# Altium schematic sheet AC-DC24_Overall.SchDoc
size A4; SheetNumber: 1; SheetTotal: 1
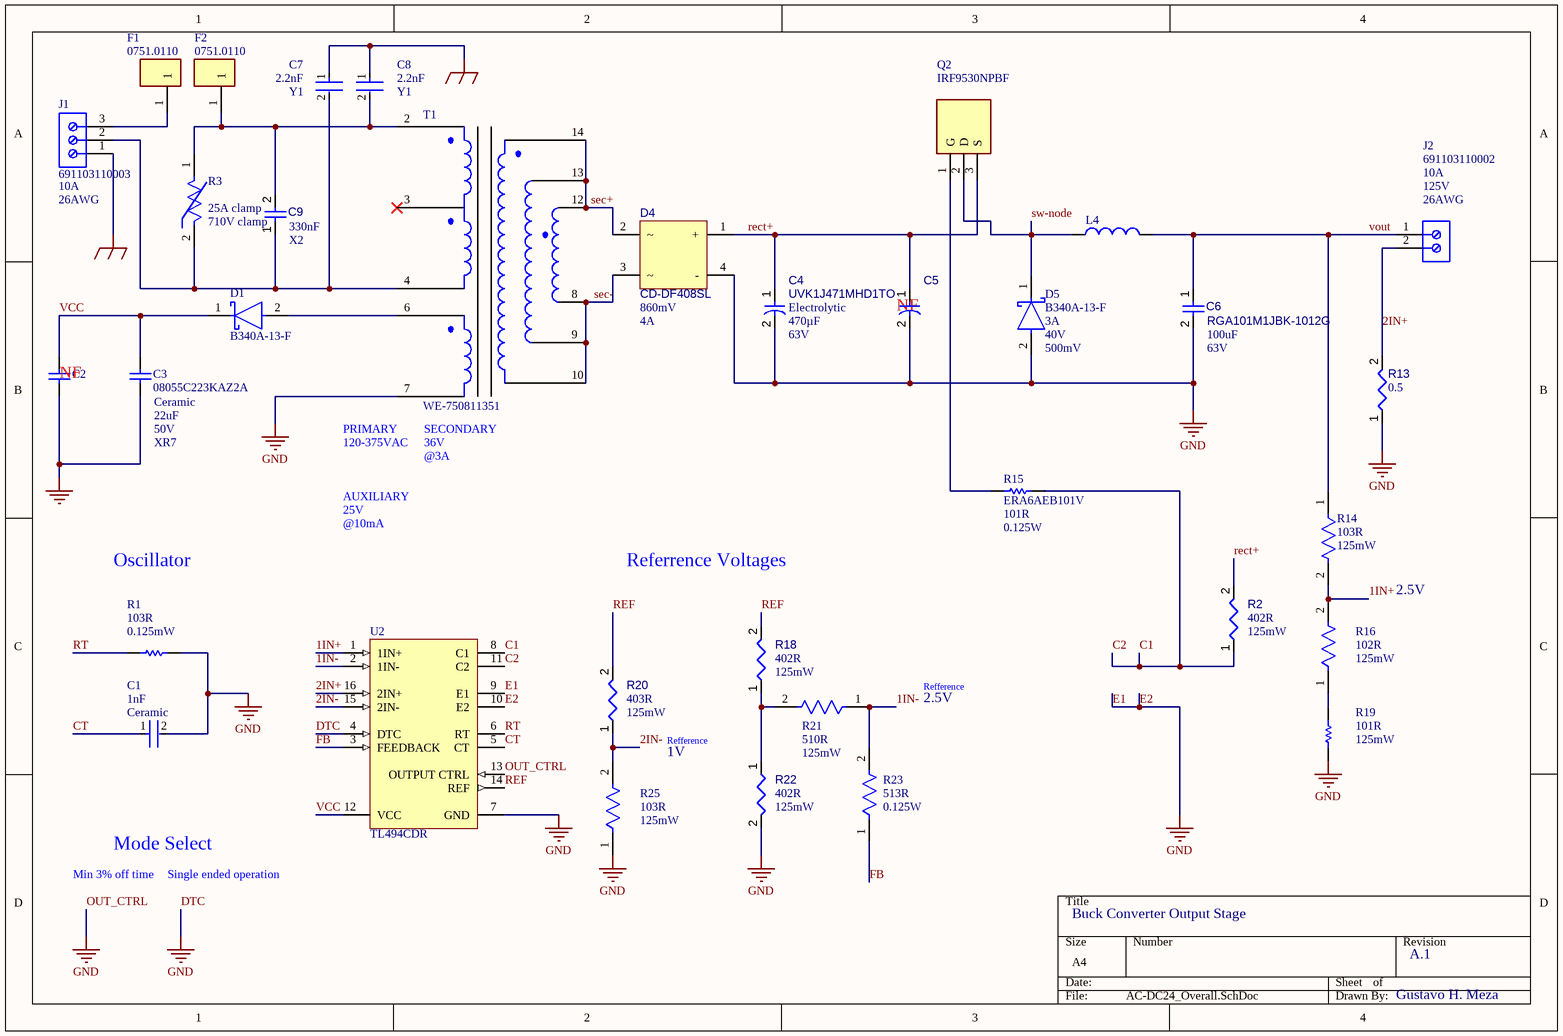
[diagram p0: AC-DC24_Overall.SchDoc]

## Parts
C1  Capacitance: 1nF  Dielectric Material: Ceramic  [FP-0805-L_2_01_0_2-W_1_25-MFG]  (hidden comment: 08051A102JAT2A)
C2  08055C223KAZ2A  [CAPC2013X94X50ML20T25]  (value not drawn)
C3  08055C223KAZ2A  Material: Ceramic  Dielectric: XR7  Voltage rating: 50V  Capacitance: 22uF  [CAPC2013X94X50ML20T25]
C4  UVK1J471MHD1TO  value 470µF  Capacitor Type: Electrolytic  Voltage Rating: 63V  [UVK1J471MHD1TO-Footprint-1]
C5  UVK1J471MHD1TO  [UVK1J471MHD1TO-Footprint-1]  (value not drawn)
C6  RGA101M1JBK-1012G  Voltage Rating: 63V  Capacitance: 100uF  [RGA101M1JBK-1012G-Footprint-1]
C7  Capacitance: 2.2nF  Safety rating: Y1  [FP-VY1470-MFG]  (hidden comment: VY1222M47Y5UQ6TV0)
C8  Capacitance: 2.2nF  Safety rating: Y1  [FP-VY1470-MFG]  (hidden comment: VY1222M47Y5UQ6TV0)
C9  value 330nF  Safety rating: X2  [B32922C3334M000-Footprint-1]  (hidden comment: B32922C3334M000)
D1  B340A-13-F  [FP-SMA-MFG]
D4  CD-DF408SL  Forward Voltage: 860mV  Forward Current: 4A  [CD-DF408SL-Footprint-1]
D5  B340A-13-F  Output Current: 3A  Voltage: 40V  Forward Voltage: 500mV  [FP-SMA-MFG]
F1  0751.0110  [FP-0751_0110-MFG]
F2  0751.0110  [FP-0751_0110-MFG]
J1  691103110003  Current Rating: 10A  Wire/Cable Gauge: 26AWG  [691103110003]
J2  691103110002  Current Rating: 10A  Voltage: 125V  Wire/Cable Gauge: 26AWG  [691103110002]
L4  FIT80-1  [FIT80-1-Footprint-1]  (value not drawn)
Q2  IRF9530NPBF  [TO254P469X1042X1967-3P]
R1  Resistance: 103R  Power: 0.125mW  [RESC2013X60X35ML10T20]  (hidden comment: RC0805JR-0710KL)
R2  value 402R  Power: 125mW  [RESC3416X05N]  (hidden comment: CRCW08054K00FKTA)
R3  Clamping Current: 25A clamp  Clamping Voltage: 710V clamp  [FP-B72210S2271K101-MFG]  (hidden comment: B72210S2271K101)
R13  value 0.5  [RS02CR5000FB12-Footprint-1]  (hidden comment: RS02CR5000FB12)
R14  Resistance: 103R  Power Rating: 125mW  [FP-CRCW0805-e3-IPC_A]  (hidden comment: CRCW080510K0FKEA)
R15  ERA6AEB101V  Resistance: 101R  Power rating: 0.125W  [RESC2013X60X40ML20T25]
R16  Power Rating: 125mW  Resistance: 102R  [FP-CRCW0805-e3-IPC_B]  (hidden comment: CRCW08051K00JNEA)
R18  value 402R  Power: 125mW  [RESC3416X05N]  (hidden comment: CRCW08054K00FKTA)
R19  Resistancemeter 1: 101R  Power: 125mW  [RESC2013X60X40ML20T25]  (hidden comment: ERA6AEB101V)
R20  value 403R  Power: 125mW  [RESC3416X05N]  (hidden comment: CRCW08054K00FKTA)
R21  Resistance: 510R  Power Rating: 125mW  [FP-CR0805-IPC_B]  (hidden comment: CR0805JW511E)
R22  value 402R  Power: 125mW  [RESC3416X05N]  (hidden comment: CRCW08054K00FKTA)
R23  value 513R  Power Rating: 0.125W  [FP-RT0805-MFG]  (hidden comment: RT0805BRD0751KL)
R25  Resistance: 103R  Max Power Dissipation: 125mW  [FP-ERA6A-IPC_C]  (hidden comment: ERA6AEB102V)
T1  WE-750811351  [WE-750811248-Footprint-1]
U2  TL494CDR  [D0016A_N]

## Nets
DTC: C1.2 C2.1 C3.1 C4.2 C5.2 C6.2 C7.1 C8.1 D4.4(-) D5.2(A) J1.1 R1.2 R13.1 R19.1 R22.2 R25.1 T1.7 U2.4(DTC) U2.7(GND) U2.9(E1) U2.10(E2) U2.13(OUTPUT_CTRL)  [also labelled E1, E2, GND, OUT_CTRL]
1IN+: R14.2 R16.2 U2.1(1IN+)
1IN-: R21.1 R23.2 U2.2(1IN-)
2IN+: J2.2 R13.2 U2.16(2IN+)
2IN-: R20.1 R25.2 U2.15(2IN-)
C1: R2.1 R15.1 U2.8(C1) U2.11(C2)  [also labelled C2]
CT: C1.1 U2.5(CT)
FB: R23.1 U2.3(FEEDBACK)
rect+: C4.1 C5.1 D4.1(+) Q2.3(S) R2.2
REF: R18.2 R20.2 U2.14(REF)
RT: R1.1 U2.6(RT)
sec+: D4.2 T1.12 T1.13 T1.14
sec-: D4.3 T1.8 T1.9 T1.10
sw-node: D5.1(C) L4.1 Q2.2(D)
VCC: C2.2 C3.2 D1.1(C) U2.12(VCC)
vout: C6.1 J2.1 L4.2 R14.1
NetC7_2: C7.2 C9.1 J1.2 R3.2 T1.4
NetC8_2: C8.2 C9.2 F2.1 R3.1 T1.2
NetD1_2: D1.2(A) T1.6
NetF1_1: F1.1 J1.3
NetQ2_1: Q2.1(G) R15.2
NetR16_1: R16.1 R19.2
NetR18_1: R18.1 R21.2 R22.1

Not connected (* = marked no-connect by the designer): T1 1 3

## Notes on the sheet
- (near C5) NF
- (near C2) NF
- (near T1) 120-375VAC
- (near T1) PRIMARY
- (near T1) 36V
- (near T1) SECONDARY
- 25V
- AUXILIARY
- @3A
- Oscillator
- @10mA
- Referrence Voltages
- 2.5V
- Refference
- 1V
- Mode Select
- Min 3% off time
- Single ended operation
- Buck Converter Output Stage
- A.1
- Gustavo H. Meza

## Library data of the parts
C1 = CMP-2007-04527-2: General Purpose Ceramic Capacitor, 0805, 1nF, 5%, C0G, 30ppm/°C, 100V; Insulation Resistance: 100GR; Dissipation Factor: 2.5%; Mount: Surface Mount; Package Quantity: 1; Voltage: 100V; Lead Free: Lead Free; Case/Package: 0805; Voltage Rating: 100V; Dielectric: C0G; Case Code (Metric): 2012; Case Code (Imperial): 0805; REACH SVHC: No SVHC; Number of Pins: 2; Length: 2.01mm; Temperature Coefficient: 30ppm/°C; Depth: 1.25mm; Radiation Hardening: No; RoHS Compliant: Yes; Packaging: Tape and Reel; Min Operating Temperature: -55°C; Contact Plating: Tin; Tolerance: 5%; Termination: SMD/SMT; Height: 0.94mm; Thickness: 0.037inch; Voltage Rating (DC): 100V; Max Operating Temperature: 125°C; Width: 1.25mm
C2 = CMP-2007-04398-1: Manufacturer: AVX Interconnect / Elco; Material: Ceramic; Dielectric: XR7; Voltage rating: 50V; Capacitance: 22uF; Part Number: 08055C223KAZ2A
C3 = CMP-2007-04398-1: Manufacturer: AVX Interconnect / Elco; Part Number: 08055C223KAZ2A
C4 = CMP-001-00087-2: Cap Alum 470UF 20% 63V Radial; Ripple Current: 900mA; Dielectric Material: Aluminium; RoHS Compliant: Yes; Diameter: 12.5mm; Max Operating Temperature: 85°C; Min Operating Temperature: -40°C; Pins: 2
C5 = CMP-001-00087-2: Cap Alum 470UF 20% 63V Radial; Capacitor Type: Electrolytic; Value: 470µF; Ripple Current: 900mA; Dielectric Material: Aluminium; RoHS Compliant: Yes; Diameter: 12.5mm; Max Operating Temperature: 85°C; Min Operating Temperature: -40°C; Voltage Rating: 63V; Pins: 2
C6 = CMP-001-00089-1: Aluminum Electrolytic Capacitors - Leaded 63V 100uF 105C 10x12.5 mm
C7 C8 = CMP-02417-000069-1: CAP CER 2200PF 760VAC Y5U RADIAL; Lead Diameter: 0.6mm; Ratings: X1; Voltage Rating (AC): 500V; Lead/Base Style: Kinked; Tolerance: 20%; Max Operating Temperature: 125°C; Resistor Type: Ceramic; Contact Plating: Tin; Thickness: 5mm; Width: 5mm; Min Operating Temperature: -40°C; Depth: 5mm; Mount: Through Hole; Termination: Radial; Lead Free: Lead Free; Diameter: 12mm; Height: 15mm; Radiation Hardening: No; Lead Pitch: 10mm; Case/Package: Radial; RoHS Compliant: Yes; Series: VY1; Dielectric: Y5U; Construction: RADIAL; Voltage: 500V; Voltage Rating (DC): 500V; Packaging: Tape and Reel; Height - Seated (Max): 0.63inch; Package Quantity: 500
C9 = CMP-001-00088-1: Film Capacitor, Polypropylene, 630V, 20% +Tol, 20% -Tol, 0.33uF, Through Hole Mount; Max Operating Temperature: 110°C; Min Operating Temperature: -40°C; RoHS Compliant: Yes; Dielectric Material: Polypropylene; Pins: 2; Height: 8mm; Mounting Technology: Through Hole; Capacitor Type: FILM; Case/Package: 7155
D1 = CMP-1667-00003-3: DIODE SCHOTTKY 40V 3A SMA; Max Forward Surge Current (Ifsm): 80A; Forward Voltage: 500mV; Polarity: Standard; Max Reverse Current: 500uA; Capacitance: 250pF; Element Configuration: Single; Mount: Surface Mount; Output Current: 3A; Radiation Hardening: No; Width: 2.92mm; Current Rating: 3A; Termination: SMD/SMT; Voltage: 40V; Series: -; Max Operating Temperature: 125°C; Current: 3A; Max Repetitive Reverse Voltage (Vrrm): 40V; Min Operating Temperature: -55°C; REACH SVHC: No SVHC; Number of Pins: 2; Average Rectified Current: 3A; Contact Plating: Tin; RoHS Compliant: Yes; Max Reverse Voltage (DC): 40V; Packaging: Tape and Reel; Height: 2.3mm; Length: 4.6mm; Case/Package: SMA; Weight: 0.002258oz; Peak Non-Repetitive Surge Current: 80A; Package Quantity: 5000; Lead Free: Lead Free; Forward Current: 3A; Voltage Rating (DC): 40V
D4 = CMP-004-00034-1: Bridge Rectifier Diode, 1 Phase, 4A, 800V V(RRM), Silicon; Max Surge Current: 150A; Reach SVHC Compliant: No; Min Operating Temperature: -55°C; Max Operating Temperature: 175°C; RoHS Compliant: Yes; Mounting Technology: Flat; JESD-609 Code: e3; Diode Type: RECTIFIER
D5 = CMP-1667-00003-3: DIODE SCHOTTKY 40V 3A SMA; Max Forward Surge Current (Ifsm): 80A; Polarity: Standard; Max Reverse Current: 500uA; Capacitance: 250pF; Element Configuration: Single; Mount: Surface Mount; Radiation Hardening: No; Width: 2.92mm; Current Rating: 3A; Termination: SMD/SMT; Series: -; Max Operating Temperature: 125°C; Current: 3A; Max Repetitive Reverse Voltage (Vrrm): 40V; Min Operating Temperature: -55°C; REACH SVHC: No SVHC; Number of Pins: 2; Average Rectified Current: 3A; Contact Plating: Tin; RoHS Compliant: Yes; Max Reverse Voltage (DC): 40V; Packaging: Tape and Reel; Height: 2.3mm; Length: 4.6mm; Case/Package: SMA; Weight: 0.002258oz; Peak Non-Repetitive Surge Current: 80A; Package Quantity: 5000; Lead Free: Lead Free; Forward Current: 3A; Voltage Rating (DC): 40V
F1 F2 = CMP-26292-000006-1: FUSE CLIP CARTRIDGE 10A PCB; Manufacturer: Schurter; Conn Orientation: Horizontal; Voltage Rating Ac: 500V; Number Of Fuses: 1; ComponentLink2Description: Datasheet; ComponentLink2URL: https://us.schurter.com/bundles/snceschurter/epim/_ProdPool_/newDS/en/typ_OG__Clip__5x20.pdf; Package: 0; Device Class L1: Circuit Protection; Lead Free: Yes; RoHS: TRUE; Voltage Rating Dc: 500V; Device Class L3: unset; Ambient Temperature Range Low: -40°C; Manufacturer Part Number: 0751.0110; Device Class L2: Fuse Holders; Octopart: https://octopart.com/0751.0110-schurter-19402; Height: 8.9mm; Digikey Description: FUSE CLIP CARTRIDGE 10A PCB; Ambient Temperature Range High: +85°C; Category: Fuse; Fuse Current: 10A; Automotive: No
J1 = CMP-1502-03255-2: NexarPartId: 18818287; Pitch: 3.5052mm; Number of Contacts: 3; Stripping Length: -6mm; Voltage Rating: 125V; Number of Levels: 1; Height: 12.2mm; Color: Blue; RoHS: Compliant; Packaging: Box; Housing Material: Nylon; Termination: Screw; Width: 11.5mm; Lead Pitch: 3.5mm; Number of Positions Per Level: 3; Number of Pins: 3; Contact Material: Brass; Length: 7mm; REACH SVHC: Unknown
J2 = CMP-1502-03254-2: NexarPartId: 18818286; Pitch: 3.5052mm; Number of Positions Per Level: 2; Plating: Steel; Number of Levels: 1; Stripping Length: -6mm; Wire Gauge (Min): 16AWG; Packaging: Box; Number of Rows: 1; Color: Blue; Height: 8.5mm; Current: 10A; Lead Pitch: 3.5mm; RoHS: Compliant; Housing Material: Nylon; Width: 8mm; Length: 7mm; Contact Plating: Tin; Number of Pins: 2; Mount: Through Hole; Min Operating Temperature: -40°C; Number of Contacts: 2; REACH SVHC: Unknown; Termination: Screw; Wire Gauge (Max): 26AWG; Max Operating Temperature: 105°C; Voltage Rating: 125V; Contact Material: Brass, Copper, Nickel, Tin, Zinc
L4 = CMP-006-00026-3: General Purpose Inductor, 128uH, 1 Element, 9863; DC Resistance (DCR): 95.2mR; Max Current Rating: 4A; Case/Size Code: 9863; Pins: 2; Inductance-Nom (L): 128uH; Construction: Toroidal; RoHS Compliant: Yes
Q2 = CMP-033-000000-2: MOSFET MOSFT PCh -100V -14A 200mOhm 38.7nC; Manufacturer_Name: Infineon; Geometry.Height: 4.69mm; Mouser Price/Stock: https://www.mouser.co.uk/ProductDetail/Infineon-Technologies/IRF9530NPBF?qs=9%252BKlkBgLFf2oWmEcBf5aZQ%3D%3D; Datasheet Link: https://www.infineon.com/dgdl/irf9530npbf.pdf?fileId=5546d462533600a401535611b9931dc1; Design Item ID: IRF9530NPBF; Manufacturer_Part_Number: IRF9530NPBF; Mouser Part Number: 942-IRF9530NPBF; Source: IRF9530NPBF.SchLib
R1 = CMP-2000-05025-1: Chip Resistor, 10 KOhm, +/- 5%, 0.125 W, -55 to 155 degC, 0805 (2012 Metric), RoHS, Tape and Reel; Manufacturer: Yageo; Resistor Element Type: ThickFilm; Voltage Rating: 150V; Product Range: RCSeries; SVHC: ToBeAdvised; Resistor Case Style: 0805[2012Metric]; Temperature Coefficient: ±100ppm/degC; Power Rating: 250mW; Automotive Qualification Standard: -; Datasheet Version: REV. 2, 09/2004; Packaging: CutTape; Resistance Tolerance: ±5%; MSL: MSL1-Unlimited; Manufacturer URL: http://www.yageo.com/; Datasheet URL: http://www.yageo.ru/pdf/RC0805.pdf; Package Description: 2-Pin Surface Mounted Device, Body 2 x 1.25 mm; Package Reference: 805
R2 R18 R20 R22 = CMP-009-00184-1: RES SMD 4K OHM 1% 1/8W 0805; Manufacturer Series: CRCW; Min Operating Temperature: -55°C; Mounting Technology: Surface Mount; Case/Package: 0805; RoHS Compliant: No; Pins: 2; Tolerance: 1%; JESD-609 Code: e0; Max Operating Temperature: 155°C
R3 = CMP-10618-000003-1: VARISTOR 430V 3.5KA DISC 10MM; Manufacturer: EPCOS; Value: 220pF; Voltage Rating Dc: 350V; Voltage Rating Ac: 275V; Voltage Tolerance: 10%; Temperature Range High: +105°C; RoHS: TRUE; Mouser Description: B722 Series 350 V 275 Vrms 710 V Clamp 3500 A 220 pF AdvanceD Leaded Varistor; ComponentLink2URL: https://www.tdk-electronics.tdk.com/inf/70/db/var/SIOV_Leaded_AdvanceD.pdf; Device Class L3: unset; Octopart: https://octopart.com/b72210s2271k101-epcos-42227876; Varistor Voltage: 430V; Category: Res; Package: 0; Temperature: -40°C to +105°C; ComponentLink2Description: Datasheet; Manufacturer Part Number: B72210S2271K101; Digikey Description: VARISTOR 430V 3.5KA DISC 10MM; Device Class L2: Varistors; Lead Free: Yes; Capacitance: 220pF; Device Class L1: Circuit Protection; Height: 14.5mm; Automotive: No; Temperature Range Low: -40°C
R13 = CMP-009-00190-2: Fixed Resistor, Wire Wound, 2.5W, 0.5ohm, 1% +/-Tol, 90ppm/Cel, Through Hole Mount; Manufacturer Series: RS; Additional Feature: PRECISION; Max Operating Temperature: 250°C; Pins: 2; Tolerance: 1%; Mounting Technology: Through Hole; Power: 2.5W; JESD-609 Code: e0; Min Operating Temperature: -65°C; RoHS Compliant: No
R14 = CMP-2001-04908-2: RES Thick Film, 10kΩ, 1%, 0.125W, 100ppm/°C, 0805; Voltage Rating (DC): 150V; Weight: 0.000194oz; Package Quantity: 5000; Military Standard: Not; Max Operating Temperature: 155°C; Temperature Coefficient: 100ppm/°C; Contact Plating: Tin; Width: 1.25mm; Height: 0.45mm; Radiation Hardening: No; Tolerance: 1%; Min Operating Temperature: -55°C; Voltage Rating: 150V; Length: 2mm; Depth: 1.25mm; Termination: SMD/SMT; Packaging: Tape and Reel; Case/Package: 0805; Case Code (Metric): 2012; Lead Free: Lead Free; Case Code (Imperial): 0805; Composition: Thick Film
R15 R19 = CMP-2001-00580-1: Manufacturer: Panasonic; Part Number: ERA6AEB101V
R16 = CMP-2001-03597-2: RES Thick Film, 1kΩ, 5%, 0.125W, 200ppm/°C, 0805; Voltage Rating: 150V; Depth: 1.25mm; Features: Automotive AEC-Q200; Case/Package: 0805; Lead Free: Lead Free; Width: 1.25mm; Temperature Coefficient: 200ppm/°C; Height: 0.02inch; Length: 2mm; Case Code (Metric): 2012; Mount: Surface Mount; Military Standard: Not; Contact Plating: Tin; Min Operating Temperature: -55°C; Number of Pins: 2; Weight: 0.000194oz; Case Code (Imperial): 0805; Packaging: Tape and Reel; Voltage Rating (DC): 150V; Number of Terminations: 2; Composition: Thick Film; Radiation Hardening: No; Tolerance: 5%; Package Quantity: 1; Max Power Dissipation: 125mW; Max Operating Temperature: 155°C; Termination: SMD/SMT
R21 = CMP-07231-001106-1: Thick Film Chip Resistors 0805 510Ω 0.125W 5% 200ppm/°C; Voltage Rating: 150V; Case Code (Imperial): 0805; Case Code (Metric): 2012; Max Operating Temperature: 155°C; Packaging: Tape and Reel; Termination: SMD/SMT; Thickness: 508um; Min Operating Temperature: -55°C; Tolerance: 5%; Height: 0.5mm; Width: 1.25mm; Length: 2mm; Case/Package: 0805; Temperature Coefficient: 200ppm/°C; Package Quantity: 5000
R23 = CMP-03412-030464-1: RES SMD 51K OHM 0.1% 1/8W 0805; Manufacturer: Yageo; Tolerance: 0.0025; Temperature Coefficient: 25 ppm/°C; Voltage Rating: 150V; Device Class L1: Passive Components; Mouser Description: Thin Film Resistors - SMD 1/8W 51K ohm .1% 25ppm; Temperature: -55°C to +155°C; Series: RT; RoHS: TRUE; ComponentLink2Description: Datasheet; Ipc Land Pattern Name: RESC200125X50; Digikey Description: RES SMD 51K OHM 0.1% 1/8W 0805; Category: Res; Temperature Range Low: -55°C; Package: RT0805; Manufacturer Part Number: RT0805BRD0751KL; ComponentLink2URL: http://www.yageo.com/documents/recent/PYu-RT_1-to-0.01_RoHS_L_9.pdf; Device Class L3: Chip SMD Resistors; Height: 0.6mm; Octopart: https://octopart.com/rt0805brd0751kl-yageo-1414977; Resistance: 51k; Footprint Url: http://www.yageo.com/exep/pages/download/literatures/PYu-R_Mount_10.pdf; Composition: Thin Film; Device Class L2: Resistors; Lead Free: Yes; Temperature Range High: +155°C; Automotive: No
R25 = CMP-2001-00581-2: RES 1K OHM 0.1% 1/8W 0805; Temperature Coefficient: 25ppm/°C; Working Voltage: 100V; Height: 0.5mm; Technology: THIN FILM; REACH SVHC: No SVHC; Packaging: Tape and Reel; Length: 2mm; Width: 1.25mm; Resistance Tolerance: 0.1%; Series: ERA-6A; Resistor Type: Thin Film; Number of Pins: 2; Case Code (Metric): 2012; Voltage Rating: 100V; Radiation Hardening: No; Construction: Rectangular; Mount: Surface Mount; Number of Terminations: 2; Case/Package: 0805; Min Operating Temperature: -55°C; Military Standard: Not; RoHS Compliant: Yes; Termination: SMD/SMT; Case Code (Imperial): 0805; Depth: 1.25mm; Power Rating: 125mW; Max Operating Temperature: 155°C; Contact Plating: Tin; Package Quantity: 5000; Tolerance: 0.1%
T1 = CMP-012-00000-5: Power Transformers MID-L3798/99 Offline Isol 3.6uH +-10%; Inductance: 300uH; Voltage Rating: 265V; Current Rating: 2A; Power: 48W; Turns Ratio: 0.167372; Mounting Technology: THT; Pins: 10; Min Operating Temperature: -40°C; Max Operating Temperature: 125°C; RoHS Compliant: Yes
U2 = CMP-0319-00950-2: Pulse-Width-Modulation Control Circuit with Voltage Control, 45 % Duty Cycle, 0 to +70 degC, 16-pin SOIC (D), Green (RoHS & no Sb/Br); Manufacturer: Texas Instruments; Regulated Outputs(#): 2; Frequency(Max)(kHz): 300; Topology: Boost, Buck, Flyback, Forward, Full-Bridge, Half-Bridge, Push-Pull; SubFamily: PWM Controller; Duty Cycle(Max)(%): 45; Rating: Military; PackageDescription: 16-Pin Plastic Small Outline Integrated Circuit, 9.9 x 3.9 mm, Pitch 1.27 mm Pitch; Mounting Technology: Surface Mount; PackageReference: D0016A; DatasheetVersion: SLVS074E; Control Method: Voltage; ComponentLink1Description: Datasheet; ComponentLink1URL: http://www.ti.com/general/docs/lit/getliterature.tsp?genericPartNumber=TL494&fileType=pdf; Code_JEDEC: MS-012AC; Eco-Plan: Green (RoHS & no Sb/Br); PackageVersion: revM, Jun-2011; PartNumber: TL494CDR